# EAGLE design breakout (EAGLE 8.2.2)
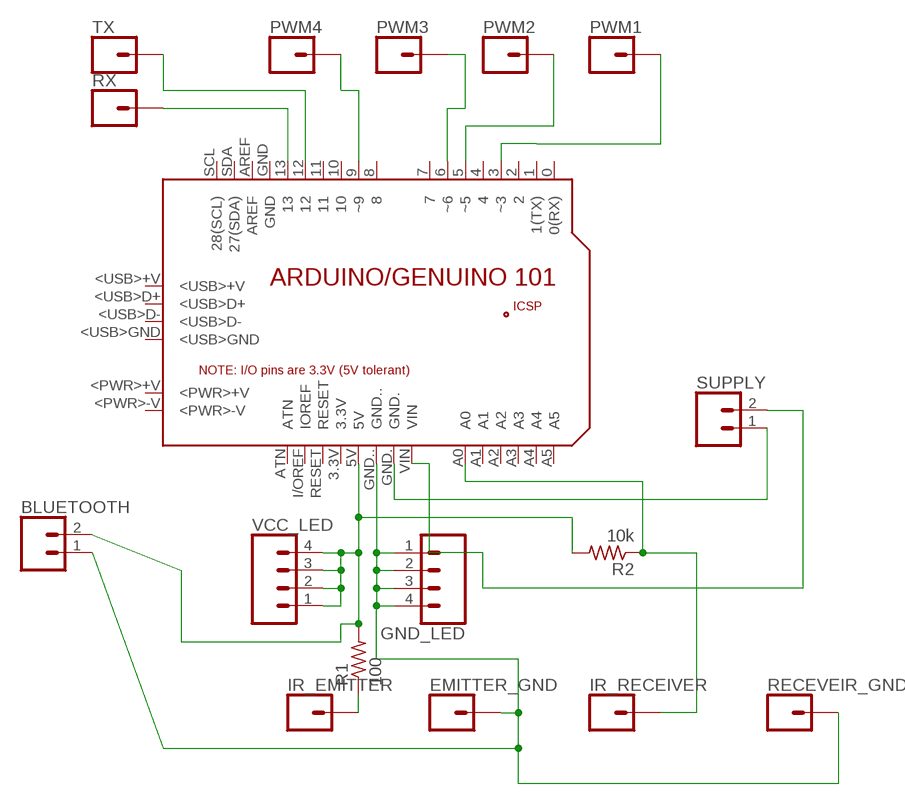
[diagram p0: schematic, sheet 1]

## Parts
BLUETOOTH  CONN_02  [1X02]
EMITTER_GND  CONN_01  [1X01]
GND_LED  CONN_04  [1X04]
IR_EMITTER  CONN_01  [1X01]
IR_RECEIVER  CONN_01  [1X01]
PCB1  ARDUINO_101  [ARDUINO_101]
PWM1  CONN_01  [1X01]
PWM2  CONN_01  [1X01]
PWM3  CONN_01  [1X01]
PWM4  CONN_01  [1X01]
R1  100  RES-US1206  [R1206]
R2  10k  RES-US1206  [R1206]
RECEVEIR_GND  CONN_01  [1X01]
RX  CONN_01  [1X01]
SUPPLY  CONN_02  [1X02]
TX  CONN_01  [1X01]
VCC_LED  CONN_04  [1X04]

## Nets
N$1: BLUETOOTH.2 PCB1.5V R1.2 R2.2 VCC_LED.1 VCC_LED.2 VCC_LED.3 VCC_LED.4
N$2: PCB1.GND. SUPPLY.1
N$3: PCB1.3(~3) PWM1.1
N$4: PCB1.9(~9) PWM4.1
N$5: PCB1.5(~5) PWM2.1
N$6: PCB1.6(~6) PWM3.1
N$7: PCB1.VIN SUPPLY.2
N$8: IR_EMITTER.1 R1.1
N$9: PCB1.13 RX.1
N$10: IR_RECEIVER.1 PCB1.A0 R2.1
N$11: PCB1.12 TX.1
N$13: BLUETOOTH.1 EMITTER_GND.1 GND_LED.1 GND_LED.2 GND_LED.3 GND_LED.4 PCB1.GND.. RECEVEIR_GND.1
Unconnected: PCB1.0(0(RX)) PCB1.1(1(TX)) PCB1.2 PCB1.3.3V PCB1.4 PCB1.7 PCB1.8 PCB1.10 PCB1.11 PCB1.+5V PCB1.<PWR>+V PCB1.<PWR>-V PCB1.<USB>+V PCB1.<USB>D+ PCB1.<USB>D- PCB1.<USB>GND PCB1.A1 PCB1.A2 PCB1.A3 PCB1.A4 PCB1.A5 PCB1.AREF PCB1.ATN PCB1.GND PCB1.GND_ PCB1.I/OREF(IOREF) PCB1.MISO PCB1.MOSI PCB1.RESET PCB1.RESET. PCB1.SCK PCB1.SCL(28(SCL)) PCB1.SDA(27(SDA))

## Library data of the parts
BLUETOOTH SUPPLY = 03_SparkFun-Connectors:CONN_02: Multi connection point. Often used as Generic Header-pin footprint for 0.1 inch spaced/style header connections On any of the 0.1 inch spaced packages, you can populate with these: Break Away Headers - Straight <https://www.sparkfun.com/products/116> (PRT-00116) Break Away Male Headers - Right Angle <https://www.sparkfun.com/products/553> (PRT-00553) Female Headers <https://www.sparkfun.com/products/115> (PRT-00115) Break Away Headers - Machine Pin <https://www.sparkfun.com/products/117> (PRT-00117) Break Away Female Headers - Swiss Machine Pin <https://www.sparkfun.com/products/743> (PRT-00743) For SCREWTERMINALS and SPRING TERMINALS visit here: Screw Terimnals on SparkFun.com <https://www.sparkfun.com/search/results?term=Screw+Terminals> (5mm/3.5mm/2.54mm spacing) This device is also useful as a general connection point to wire up your design to another part of your project. Our various solder wires solder well into these plated through hole pads. Hook-Up Wire - Assortment (Stranded, 22 AWG) <https://www.sparkfun.com/products/11375> (PRT-11375) Hook-Up Wire - Assortment (Solid Core, 22 AWG) <https://www.sparkfun.com/products/11367> (PRT-11367) View the entire wire category on our website here <https://www.sparkfun.com/categories/141> Special notes: Molex polarized connector foot print use with: PRT-08233 with associated crimp pins and housings. 2.54_SCREWTERM for use with PRT-10571. 3.5mm Screw Terminal footprints for PRT-08084 5mm Screw Terminal footprints for use with PRT-08432
EMITTER_GND IR_EMITTER IR_RECEIVER PWM1-PWM4 RECEVEIR_GND RX TX = 03_SparkFun-Connectors:CONN_01: Single connection point. Often used as Generic Header-pin footprint for 0.1 inch spaced/style header connections On any of the 0.1 inch spaced packages, you can populate with these: Break Away Headers - Straight <https://www.sparkfun.com/products/116> (PRT-00116) Break Away Male Headers - Right Angle <https://www.sparkfun.com/products/553> (PRT-00553) Female Headers <https://www.sparkfun.com/products/115> (PRT-00115) Break Away Headers - Machine Pin <https://www.sparkfun.com/products/117> (PRT-00117) Break Away Female Headers - Swiss Machine Pin <https://www.sparkfun.com/products/743> (PRT-00743) This device is also useful as a general connection point to wire up your design to another part of your project. Our various solder wires solder well into these plated through hole pads. Hook-Up Wire - Assortment (Stranded, 22 AWG) <https://www.sparkfun.com/products/11375> (PRT-11375) Hook-Up Wire - Assortment (Solid Core, 22 AWG) <https://www.sparkfun.com/products/11367> (PRT-11367) View the entire wire category on our website here <https://www.sparkfun.com/categories/141> Special notes: SMTSO-256-ET is a "flush mount" nut for a 4-40 screw. We mostly use this on specialty testbeds; it is a nice way to connect hardware to your PCB at an adjustable hieght. Also note, the SNAP packages are for using a snappable style connector. We sell a baggie of snaps and they are also used on two LilyPad designs: Snap Assortment - 30 pack (male and female) <https://www.sparkfun.com/products/11347> (DEV-11347) LilyPad Arduino SimpleSnap <https://www.sparkfun.com/products/10941> (DEV-10941) LilyPad SimpleSnap Protoboard <https://www.sparkfun.com/products/10940> (DEV-10940)
GND_LED VCC_LED = 03_SparkFun-Connectors:CONN_04: Multi connection point. Often used as Generic Header-pin footprint for 0.1 inch spaced/style header connections On any of the 0.1 inch spaced packages, you can populate with these: Break Away Headers - Straight <https://www.sparkfun.com/products/116> (PRT-00116) Break Away Male Headers - Right Angle <https://www.sparkfun.com/products/553> (PRT-00553) Female Headers <https://www.sparkfun.com/products/115> (PRT-00115) Break Away Headers - Machine Pin <https://www.sparkfun.com/products/117> (PRT-00117) Break Away Female Headers - Swiss Machine Pin <https://www.sparkfun.com/products/743> (PRT-00743) For SCREWTERMINALS and SPRING TERMINALS visit here: Screw Terimnals on SparkFun.com <https://www.sparkfun.com/search/results?term=Screw+Terminals> (5mm/3.5mm/2.54mm spacing) This device is also useful as a general connection point to wire up your design to another part of your project. Our various solder wires solder well into these plated through hole pads. Hook-Up Wire - Assortment (Stranded, 22 AWG) <https://www.sparkfun.com/products/11375> (PRT-11375) Hook-Up Wire - Assortment (Solid Core, 22 AWG) <https://www.sparkfun.com/products/11367> (PRT-11367) View the entire wire category on our website here <https://www.sparkfun.com/categories/141> Special notes: Molex polarized connector foot print use with SKU : PRT-08231 with associated crimp pins and housings. 1MM SMD Version SKU: PRT-10208; PROD_ID: CONN-09696
PCB1 = 04_Arduino_Genuino_101:ARDUINO_101: Schematic symbol for representing an Arduino/Genuino 101 board in an EAGLE schematic. Created by Dave Young for Element14. More 101 documentation at: https://www.element14.com/community/docs/DOC-80459/l/intel-genuino-101-development-board More EAGLE documentation at: http://www.element14.com/community/community/knode/cadsoft_eagle
R1 R2 = 00_fab:RES-US: Resistor (US Symbol) Variants with postfix FAB are widened to allow the routing of internal traces

## Board
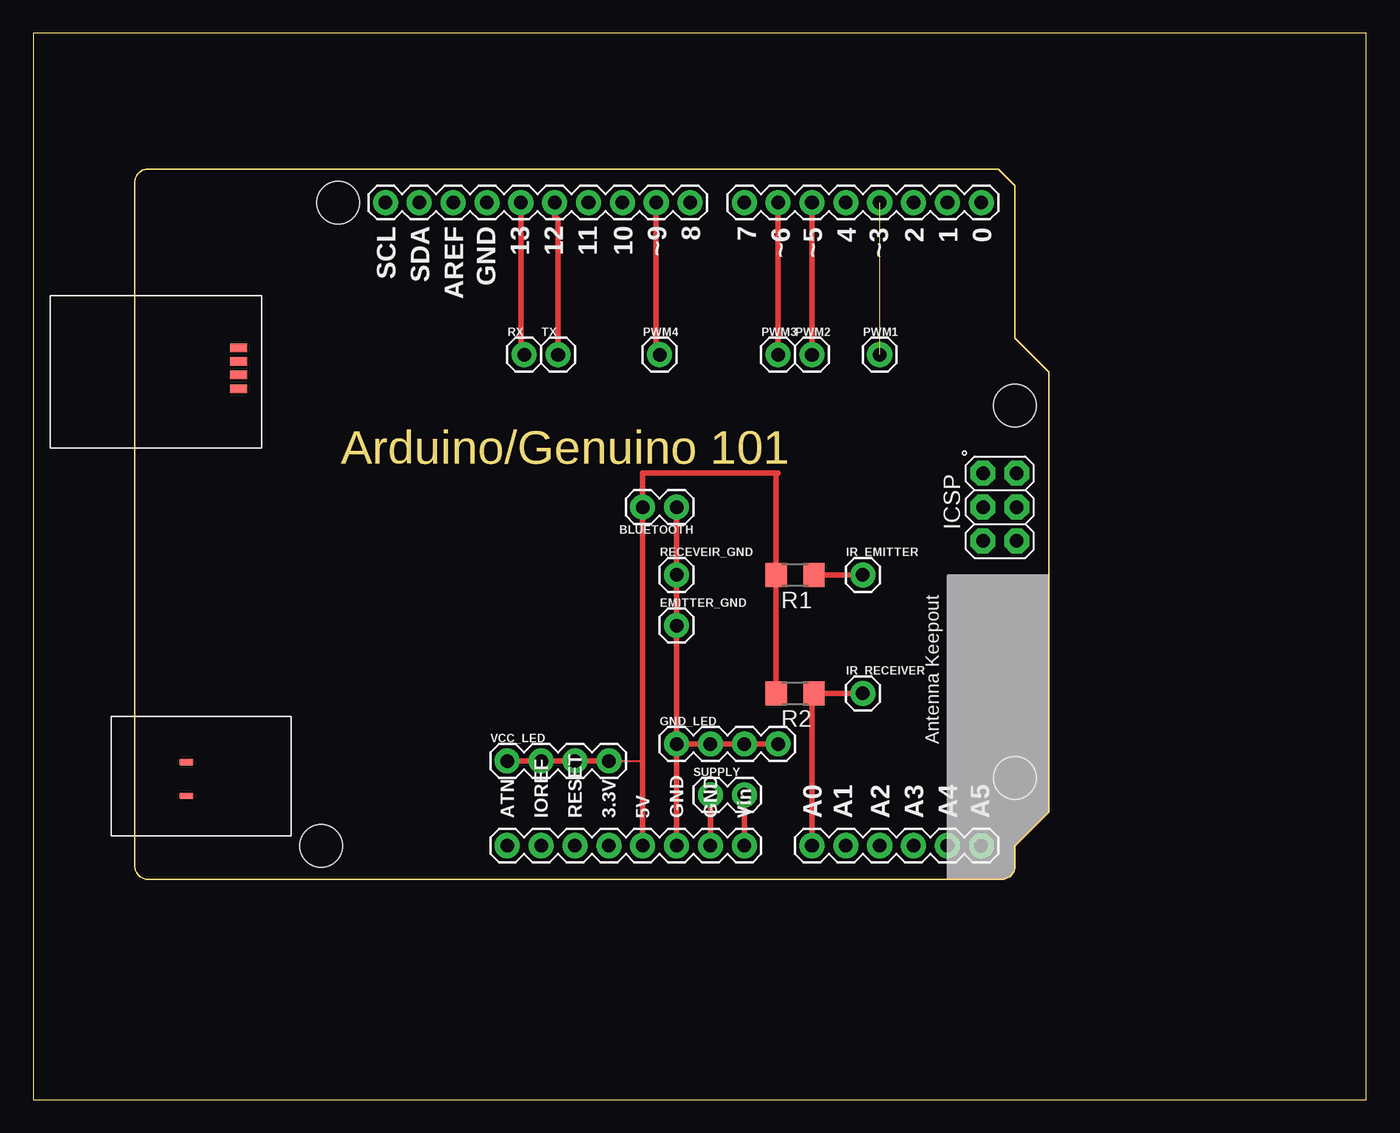
[diagram p1: board, top side]

Size 100 x 80 mm. Coordinates in mm from the lower left corner, seen from the top.
Outline: 0,0 100,0 100,80 0,80 0,0
Copper layers (1*16): Top 0.035mm / dielectric 1.5mm / Bottom 0.035mm
Design rules "default": minimum track width 10mil, minimum drill 24mil, track to track 8mil, track to pad 8mil, pad to pad 8mil, via to via 8mil, smd to smd 8mil, copper to edge 40mil, drill to drill 8mil, minimum pad ring 10mil, minimum via ring 8mil, stop-mask expansion 4mil, vias tented up to drill 0mil, thermal gap 10mil

### Footprints (pad centres in the part's own frame; a part is rotated, then mirrored left to right if it is on the bottom)
1X02 = drill 1.016 pad 1.88: 1 0,0; 2 2.54,0
1X01 = drill 1.016 pad 1.88: 1 0,0
1X04 = drill 1.016 pad 1.88: 1 0,0; 2 2.54,0; 3 5.08,0; 4 7.62,0
ARDUINO_101 = drill 1.016 pad 1.88: 0 27.94,25.4; 1 25.4,25.4; 2 22.86,25.4; 3 20.32,25.4; 3.3V 0,-22.86; 4 17.78,25.4; 5 15.24,25.4; 5V 2.54,-22.86; 6 12.7,25.4; 7 10.16,25.4; 8 6.096,25.4; 9 3.556,25.4; 10 1.016,25.4; 11 -1.524,25.4; 12 -4.064,25.4; 13 -6.604,25.4; A0 15.24,-22.86; A1 17.78,-22.86; A2 20.32,-22.86; A3 22.86,-22.86; A4 25.4,-22.86; A5 27.94,-22.86; AREF -11.684,25.4; ATN -7.62,-22.86; GND -9.144,25.4; GND. 7.62,-22.86; GND.. 5.08,-22.86; I/OREF -5.08,-22.86; RESET -2.54,-22.86; SCL -16.764,25.4; SDA -14.224,25.4; VIN 10.16,-22.86 | drill 1.016 pad 1.88 octagon: +5V 30.607,5.08; GND_ 30.607,0; MISO 28.067,5.08; MOSI 30.607,2.54; RESET. 28.067,0; SCK 28.067,2.54 | smd 1.016 x 0.508: <PWR>+V -31.699,-16.586; <PWR>-V -31.699,-19.126 | smd 1.27 x 0.635: <USB>+V -27.788,14.478; <USB>D+ -27.788,13.487; <USB>D- -27.788,12.471; <USB>GND -27.788,11.43 | hole 3.2: 30.48,-17.78; 30.48,10.16; -20.32,25.4; -21.59,-22.86
R1206 = smd 1.6 x 1.803: 1 -1.422,0; 2 1.422,0

### Placement (x,y rotation side)
BLUETOOTH  48.26,44.45 180 top
EMITTER_GND  48.26,35.56 0 top
GND_LED  48.26,26.67 0 top
IR_EMITTER  62.23,39.37 0 top
IR_RECEIVER  62.23,30.48 0 top
PCB1  43.18,41.91 0 top
PWM1  63.5,55.88 0 top
PWM2  58.42,55.88 0 top
PWM3  55.88,55.88 0 top
PWM4  46.99,55.88 0 top
R1  57.15,39.37 180 top
R2  57.15,30.48 180 top
RECEVEIR_GND  48.26,39.37 0 top
RX  36.83,55.88 0 top
SUPPLY  50.8,22.86 0 top
TX  39.37,55.88 0 top
VCC_LED  35.56,25.4 0 top

### Tracks (layer width: path | path; a pad name or v marks a point on that pad's centre or on a via)
N$1
  Top 0.152: VCC_LED.4 45.65,25.4 45.72,25.32
  Top 0.406: VCC_LED.4 VCC_LED.3 VCC_LED.2 VCC_LED.1 | R2.2 R1.2 55.73,46.84 55.88,46.99 45.72,46.99 BLUETOOTH.2 45.72,25.32 PCB1.5V
N$2
  Top 0.406: PCB1.GND. SUPPLY.1
N$3  (1 unrouted)
N$4
  Top 0.406: PWM4.1 46.74,55.88 PCB1.9
N$5
  Top 0.406: PWM2.1 PCB1.5
N$6
  Top 0.406: PWM3.1 PCB1.6
N$7
  Top 0.406: PCB1.VIN SUPPLY.2
N$8
  Top 0.406: R1.1 IR_EMITTER.1
N$9
  Top 0.406: RX.1 36.58,56.13 PCB1.13
N$10
  Top 0.406: PCB1.A0 58.42,30.33 R2.1 IR_RECEIVER.1
N$11
  Top 0.406: TX.1 39.37,66.04 39.12,66.29 PCB1.12
N$13
  Top 0.406: GND_LED.1 PCB1.GND.. | GND_LED.1 GND_LED.2 GND_LED.3 GND_LED.4 | BLUETOOTH.1 RECEVEIR_GND.1 EMITTER_GND.1 GND_LED.1